# EAGLE design farmlab (EAGLE 9.5.2)
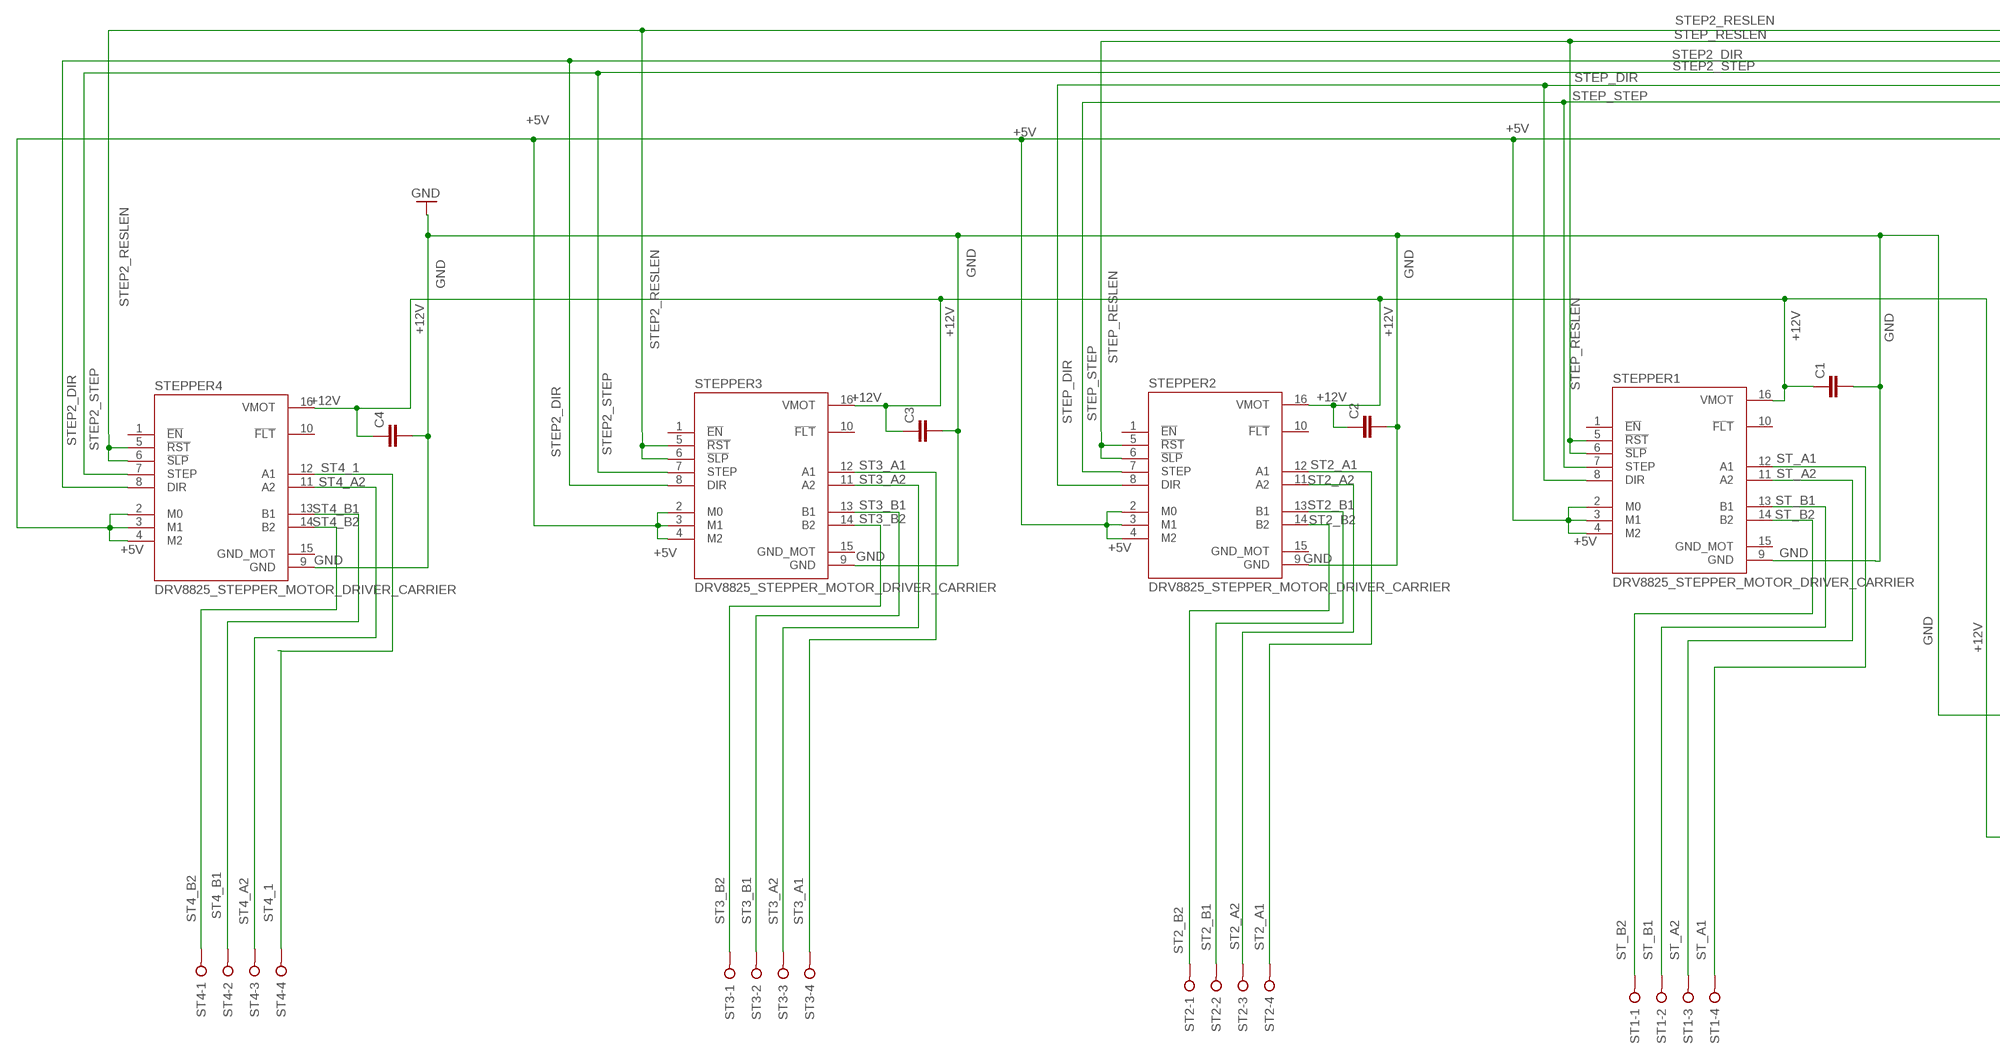
[diagram p0: schematic, sheet 1, part 1 of 2]
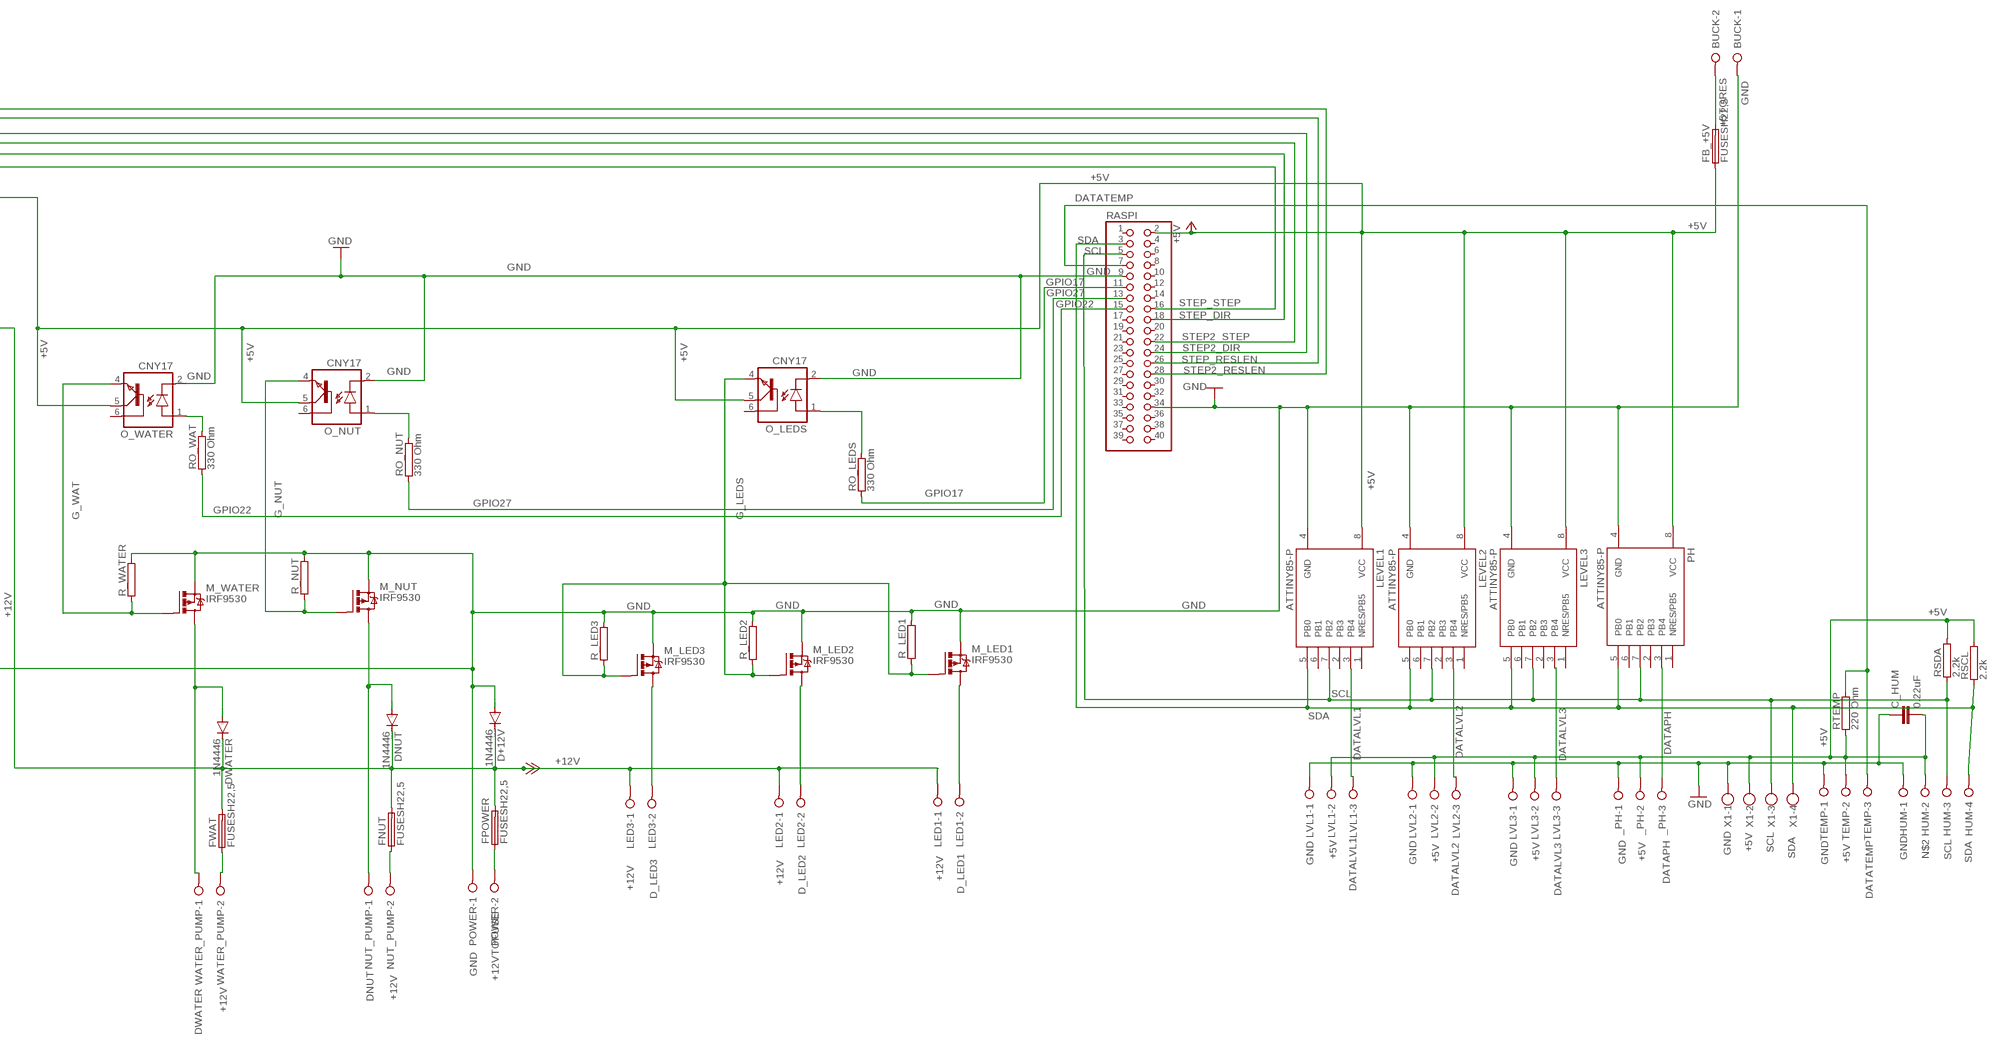
[diagram p1: schematic, sheet 1, part 2 of 2]

## Parts
_PH  W237-3E  [W237-3E]
BUCK  W237-02P  [W237-132]
C1  C2.5/6  [C2.5-6]
C2  C2.5/6  [C2.5-6]
C3  C2.5/6  [C2.5-6]
C4  C2.5/6  [C2.5-6]
C_HUM  0.22uF  C2.5/6  [C2.5-6]
D+12V  1N4446  [DO35-10]
DNUT  1N4446  [DO35-10]
DWATER  1N4446  [DO35-10]
FB_+5V  FUSESH22,5  [SH22,5]
FNUT  FUSESH22,5  [SH22,5]
FPOWER  FUSESH22,5  [SH22,5]
FWAT  FUSESH22,5  [SH22,5]
HUM  W237-04P  [W237-4P]
LED1  W237-02P  [W237-132]
LED2  W237-02P  [W237-132]
LED3  W237-02P  [W237-132]
LEVEL1  ATTINY85-P  [PDIP08_300MIL]
LEVEL2  ATTINY85-P  [PDIP08_300MIL]
LEVEL3  ATTINY85-P  [PDIP08_300MIL]
LVL1  W237-3E  [W237-3E]
LVL2  W237-3E  [W237-3E]
LVL3  W237-3E  [W237-3E]
M_LED1  IRF9530  [TO220BV]
M_LED2  IRF9530  [TO220BV]
M_LED3  IRF9530  [TO220BV]
M_NUT  IRF9530  [TO220BV]
M_WATER  IRF9530  [TO220BV]
NUT_PUMP  W237-02P  [W237-132]
O_LEDS  CNY17  [DIL06]
O_NUT  CNY17  [DIL06]
O_WATER  CNY17  [DIL06]
PH  ATTINY85-P  [PDIP08_300MIL]
POWER  W237-02P  [W237-132]
R_LED1  RAC03  [AC03]
R_LED2  RAC03  [AC03]
R_LED3  RAC03  [AC03]
R_NUT  RAC03  [AC03]
R_WATER  RAC03  [AC03]
RASPI  PINHD-2X20  [2X20]
RO_LEDS  330 Ohm  RAC03  [AC03]
RO_NUT  330 Ohm  RAC03  [AC03]
RO_WAT  330 Ohm  RAC03  [AC03]
RSCL  2.2k  RAC03  [AC03]
RSDA  2.2k  RAC03  [AC03]
RTEMP  220 Ohm  RAC03  [AC03]
ST1  W237-04P  [W237-4P]
ST2  W237-04P  [W237-4P]
ST3  W237-04P  [W237-4P]
ST4  W237-04P  [W237-4P]
STEPPER1  DRV8825_STEPPER_MOTOR_DRIVER_CARRIER  [IC_DRV8825_STEPPER_MOTOR_DRIVER_CARRIER]
STEPPER2  DRV8825_STEPPER_MOTOR_DRIVER_CARRIER  [IC_DRV8825_STEPPER_MOTOR_DRIVER_CARRIER]
STEPPER3  DRV8825_STEPPER_MOTOR_DRIVER_CARRIER  [IC_DRV8825_STEPPER_MOTOR_DRIVER_CARRIER]
STEPPER4  DRV8825_STEPPER_MOTOR_DRIVER_CARRIER  [IC_DRV8825_STEPPER_MOTOR_DRIVER_CARRIER]
TEMP  W237-3E  [W237-3E]
WATER_PUMP  W237-02P  [W237-132]
X1  W237-4  [W237-4]

## Nets
+5TORES [5V]: BUCK.2 FB_+5V.2
+5V [5V]: _PH.2 C_HUM.2 FB_+5V.1 LEVEL1.8(VCC) LEVEL2.8(VCC) LEVEL3.8(VCC) LVL1.2 LVL2.2 LVL3.2 O_LEDS.5(COL) O_NUT.5(COL) O_WATER.5(COL) PH.8(VCC) RASPI.2 RSCL.2 RSDA.2 RTEMP.1 STEPPER1.2(M0) STEPPER1.3(M1) STEPPER1.4(M2) STEPPER2.2(M0) STEPPER2.3(M1) STEPPER2.4(M2) STEPPER3.2(M0) STEPPER3.3(M1) STEPPER3.4(M2) STEPPER4.2(M0) STEPPER4.3(M1) STEPPER4.4(M2) TEMP.2 X1.2
+12V: C1.1 C2.1 C3.1 C4.1 D+12V.C DNUT.C DWATER.C FNUT.2 FPOWER.2 FWAT.2 LED1.1 LED2.1 LED3.1 STEPPER1.16(VMOT) STEPPER2.16(VMOT) STEPPER3.16(VMOT) STEPPER4.16(VMOT)
+12VTOFUSE: FPOWER.1 POWER.2
D_LED1: LED1.2 M_LED1.D
D_LED2: LED2.2 M_LED2.D
D_LED3: LED3.2 M_LED3.D
DATALVL1: LEVEL1.3(PB4) LVL1.3
DATALVL2: LEVEL2.3(PB4) LVL2.3
DATALVL3: LEVEL3.3(PB4) LVL3.3
DATAPH: _PH.3 PH.3(PB4)
DATATEMP: RASPI.7 RTEMP.2 TEMP.3
DNUT [GND]: DNUT.A M_NUT.D NUT_PUMP.1
DWATER: DWATER.A M_WATER.D WATER_PUMP.1
G_LEDS: M_LED1.G M_LED2.G M_LED3.G O_LEDS.4(EMI) R_LED1.1 R_LED2.1 R_LED3.1
G_NUT: M_NUT.G O_NUT.4(EMI) R_NUT.1
G_WAT: M_WATER.G O_WATER.4(EMI) R_WATER.1
GND [GND]: _PH.1 BUCK.1 C1.2 C2.2 C3.2 C4.2 C_HUM.1 D+12V.A HUM.1 LEVEL1.4(GND) LEVEL2.4(GND) LEVEL3.4(GND) LVL1.1 LVL2.1 LVL3.1 M_LED1.S M_LED2.S M_LED3.S M_NUT.S M_WATER.S O_LEDS.2(C) O_NUT.2(C) O_WATER.2(C) PH.4(GND) POWER.1 R_LED1.2 R_LED2.2 R_LED3.2 R_NUT.2 R_WATER.2 RASPI.9 RASPI.34 STEPPER1.9(GND) STEPPER2.9(GND) STEPPER3.9(GND) STEPPER4.9(GND) TEMP.1 X1.1
GPIO17: RASPI.11 RO_LEDS.1
GPIO22: RASPI.15 RO_WAT.1
GPIO27: RASPI.13 RO_NUT.1
N$2 [5V]: HUM.2
N$3: O_WATER.1(A) RO_WAT.2
N$4: O_NUT.1(A) RO_NUT.2
N$5: O_LEDS.1(A) RO_LEDS.2
N$6: FNUT.1 NUT_PUMP.2
N$8: FWAT.1 WATER_PUMP.2
SCL: HUM.3 LEVEL1.7(PB2) LEVEL2.7(PB2) LEVEL3.7(PB2) PH.7(PB2) RASPI.5 RSDA.1 X1.3
SDA: HUM.4 LEVEL1.5(PB0) LEVEL2.5(PB0) LEVEL3.5(PB0) PH.5(PB0) RASPI.3 RSCL.1 X1.4
ST2_A1: ST2.4 STEPPER2.12(A1)
ST2_A2: ST2.3 STEPPER2.11(A2)
ST2_B1: ST2.2 STEPPER2.13(B1)
ST2_B2: ST2.1 STEPPER2.14(B2)
ST3_A1: ST3.4 STEPPER3.12(A1)
ST3_A2: ST3.3 STEPPER3.11(A2)
ST3_B1: ST3.2 STEPPER3.13(B1)
ST3_B2: ST3.1 STEPPER3.14(B2)
ST4_1: ST4.4 STEPPER4.12(A1)
ST4_A2: ST4.3 STEPPER4.11(A2)
ST4_B1: ST4.2 STEPPER4.13(B1)
ST4_B2: ST4.1 STEPPER4.14(B2)
ST_A1: ST1.4 STEPPER1.12(A1)
ST_A2: ST1.3 STEPPER1.11(A2)
ST_B1: ST1.2 STEPPER1.13(B1)
ST_B2: ST1.1 STEPPER1.14(B2)
STEP2_DIR: RASPI.24 STEPPER3.8(DIR) STEPPER4.8(DIR)
STEP2_RESLEN: RASPI.28 STEPPER3.5(!RST) STEPPER3.6(!SLP) STEPPER4.5(!RST) STEPPER4.6(!SLP)
STEP2_STEP: RASPI.22 STEPPER3.7(STEP) STEPPER4.7(STEP)
STEP_DIR: RASPI.18 STEPPER1.8(DIR) STEPPER2.8(DIR)
STEP_RESLEN: RASPI.26 STEPPER1.5(!RST) STEPPER1.6(!SLP) STEPPER2.5(!RST) STEPPER2.6(!SLP)
STEP_STEP: RASPI.16 STEPPER1.7(STEP) STEPPER2.7(STEP)
Unconnected: LEVEL1.1(NRES/PB5) LEVEL1.2(PB3) LEVEL1.6(PB1) LEVEL2.1(NRES/PB5) LEVEL2.2(PB3) LEVEL2.6(PB1) LEVEL3.1(NRES/PB5) LEVEL3.2(PB3) LEVEL3.6(PB1) O_LEDS.6(BAS) O_NUT.6(BAS) O_WATER.6(BAS) PH.1(NRES/PB5) PH.2(PB3) PH.6(PB1) RASPI.1 RASPI.4 RASPI.6 RASPI.8 RASPI.10 RASPI.12 RASPI.14 RASPI.17 RASPI.19 RASPI.20 RASPI.21 RASPI.23 RASPI.25 RASPI.27 RASPI.29 RASPI.30 RASPI.31 RASPI.32 RASPI.33 RASPI.35 RASPI.36 RASPI.37 RASPI.38 RASPI.39 RASPI.40 STEPPER1.1(!EN) STEPPER1.10(!FLT) STEPPER2.1(!EN) STEPPER2.10(!FLT) STEPPER3.1(!EN) STEPPER3.10(!FLT) STEPPER4.1(!EN) STEPPER4.10(!FLT)

## Power pins joined to a net without a drawn wire
GND_MOT: STEPPER1.15(GND_MOT) STEPPER2.15(GND_MOT) STEPPER3.15(GND_MOT) STEPPER4.15(GND_MOT)

## Library data of the parts
_PH LVL1-LVL3 TEMP = con-wago-508:W237-3E: WAGO SREW CLAMP; OC_FARNELL: unknown; OC_NEWARK: unknown
BUCK LED1-LED3 NUT_PUMP POWER WATER_PUMP = con-wago-508:W237-02P: WAGO SREW CLAMP; OC_FARNELL: unknown; OC_NEWARK: unknown
C1-C4 C_HUM = capacitor-wima:C: CAPACITOR naming: grid - package width
D+12V DNUT DWATER = diode:1N4446: DIODE high speed (Philips)
FB_+5V FNUT FPOWER FWAT = fuse:FUSE: Fuse; OC_FARNELL: unknown; OC_NEWARK: unknown
HUM ST1-ST4 = con-wago-508:W237-04P: WAGO SREW CLAMP; OC_FARNELL: unknown; OC_NEWARK: unknown
LEVEL1-LEVEL3 PH = _hhn_attiny25_45_85:ATTINY85*: ATMEL ATtiny 85 Packages: P = PDIP 08 30mil S = SOIC 08 EIAJ 208mil Technologies Note: for complete ordering code (temp. range, finish, tape&reel etc.) see www.atmel.com • Supply Voltage: V = (1.8…5.5)V | [blank] = (2.7…5.5)V • Speed: 10 = 10 MHz | 20 = 20 MHz Author: Dipl.-Ing. FH Rainer Bayer HHN Hochschule Heilbronn (Heilbronn University), rainer.bayer@hs-heilbronn.de Ingenieurbüro ing-rb, mail@ing-rb.de
M_LED1-M_LED3 M_NUT M_WATER = transistor-power:IRF9530: P-CHANNEL HEXFET POWER-MOS-FET Source: http://www.irf.com/product-info/datasheets/data/irf9530.pdf
O_LEDS O_NUT O_WATER = optocoupler:CNY17: SIEMENS OPTO COUPLER; MPN: CNY17-1; OC_FARNELL: 1045399; OC_NEWARK: 05M4044
R_LED1-R_LED3 R_NUT R_WATER RO_LEDS RO_NUT RO_WAT RSCL RSDA RTEMP = resistor-power:R: Power Resitor; OC_FARNELL: unknown; OC_NEWARK: unknown
RASPI = pinhead:PINHD-2X20: PIN HEADER
STEPPER1-STEPPER4 = DRV8825_STEPPER_MOTOR_DRIVER_CARRIER:DRV8825_STEPPER_MOTOR_DRIVER_CARRIER: Stepper motor controler; IC: DRV8825; 1.5A; Uin mot: 8.2÷45V; AVAILABILITY: Unavailable; DESCRIPTION: Stepper motor controler; IC: DRV8825; 1.5A; Uin mot: 8.2÷45V; MF: Pololu; MP: DRV8825 STEPPER MOTOR DRIVER CARRIER; PACKAGE: None; PRICE: None
X1 = con-wago-500:W237-4: WAGO SCREW CLAMP; OC_FARNELL: unknown; OC_NEWARK: unknown

## Net classes
1 GND: width 0.5 mm
2 5V: width 0.5 mm
3 12V: width 0.1 mm
4 SDA: width 0.5 mm
5 SCL: width 0.5 mm

## Board
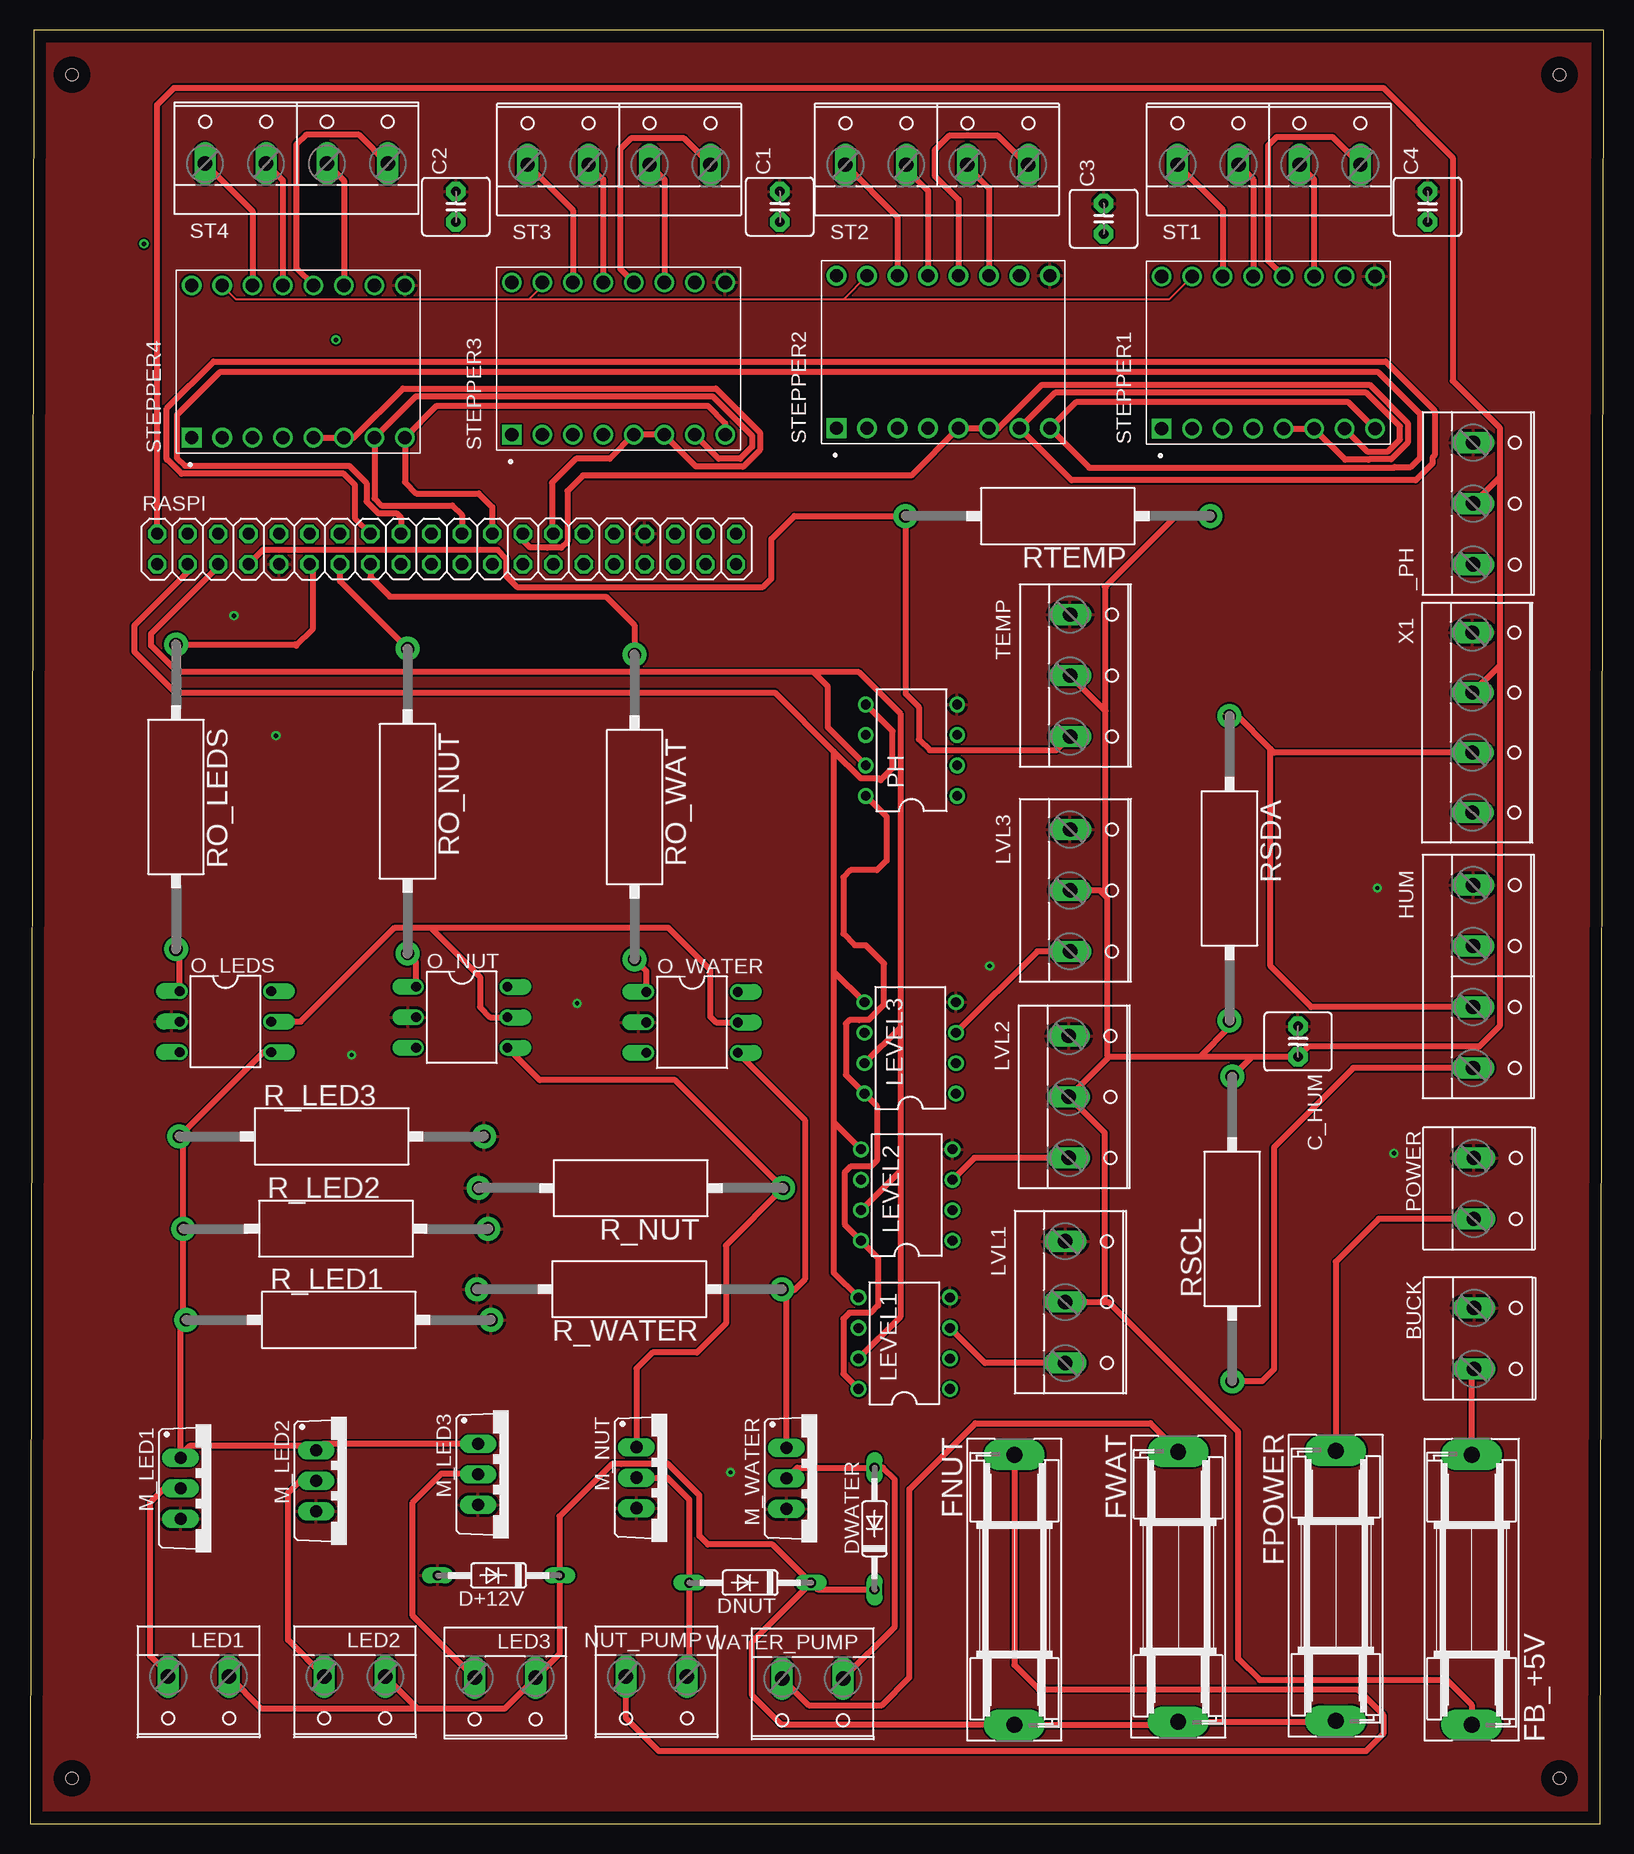
[diagram p2: board, top side]
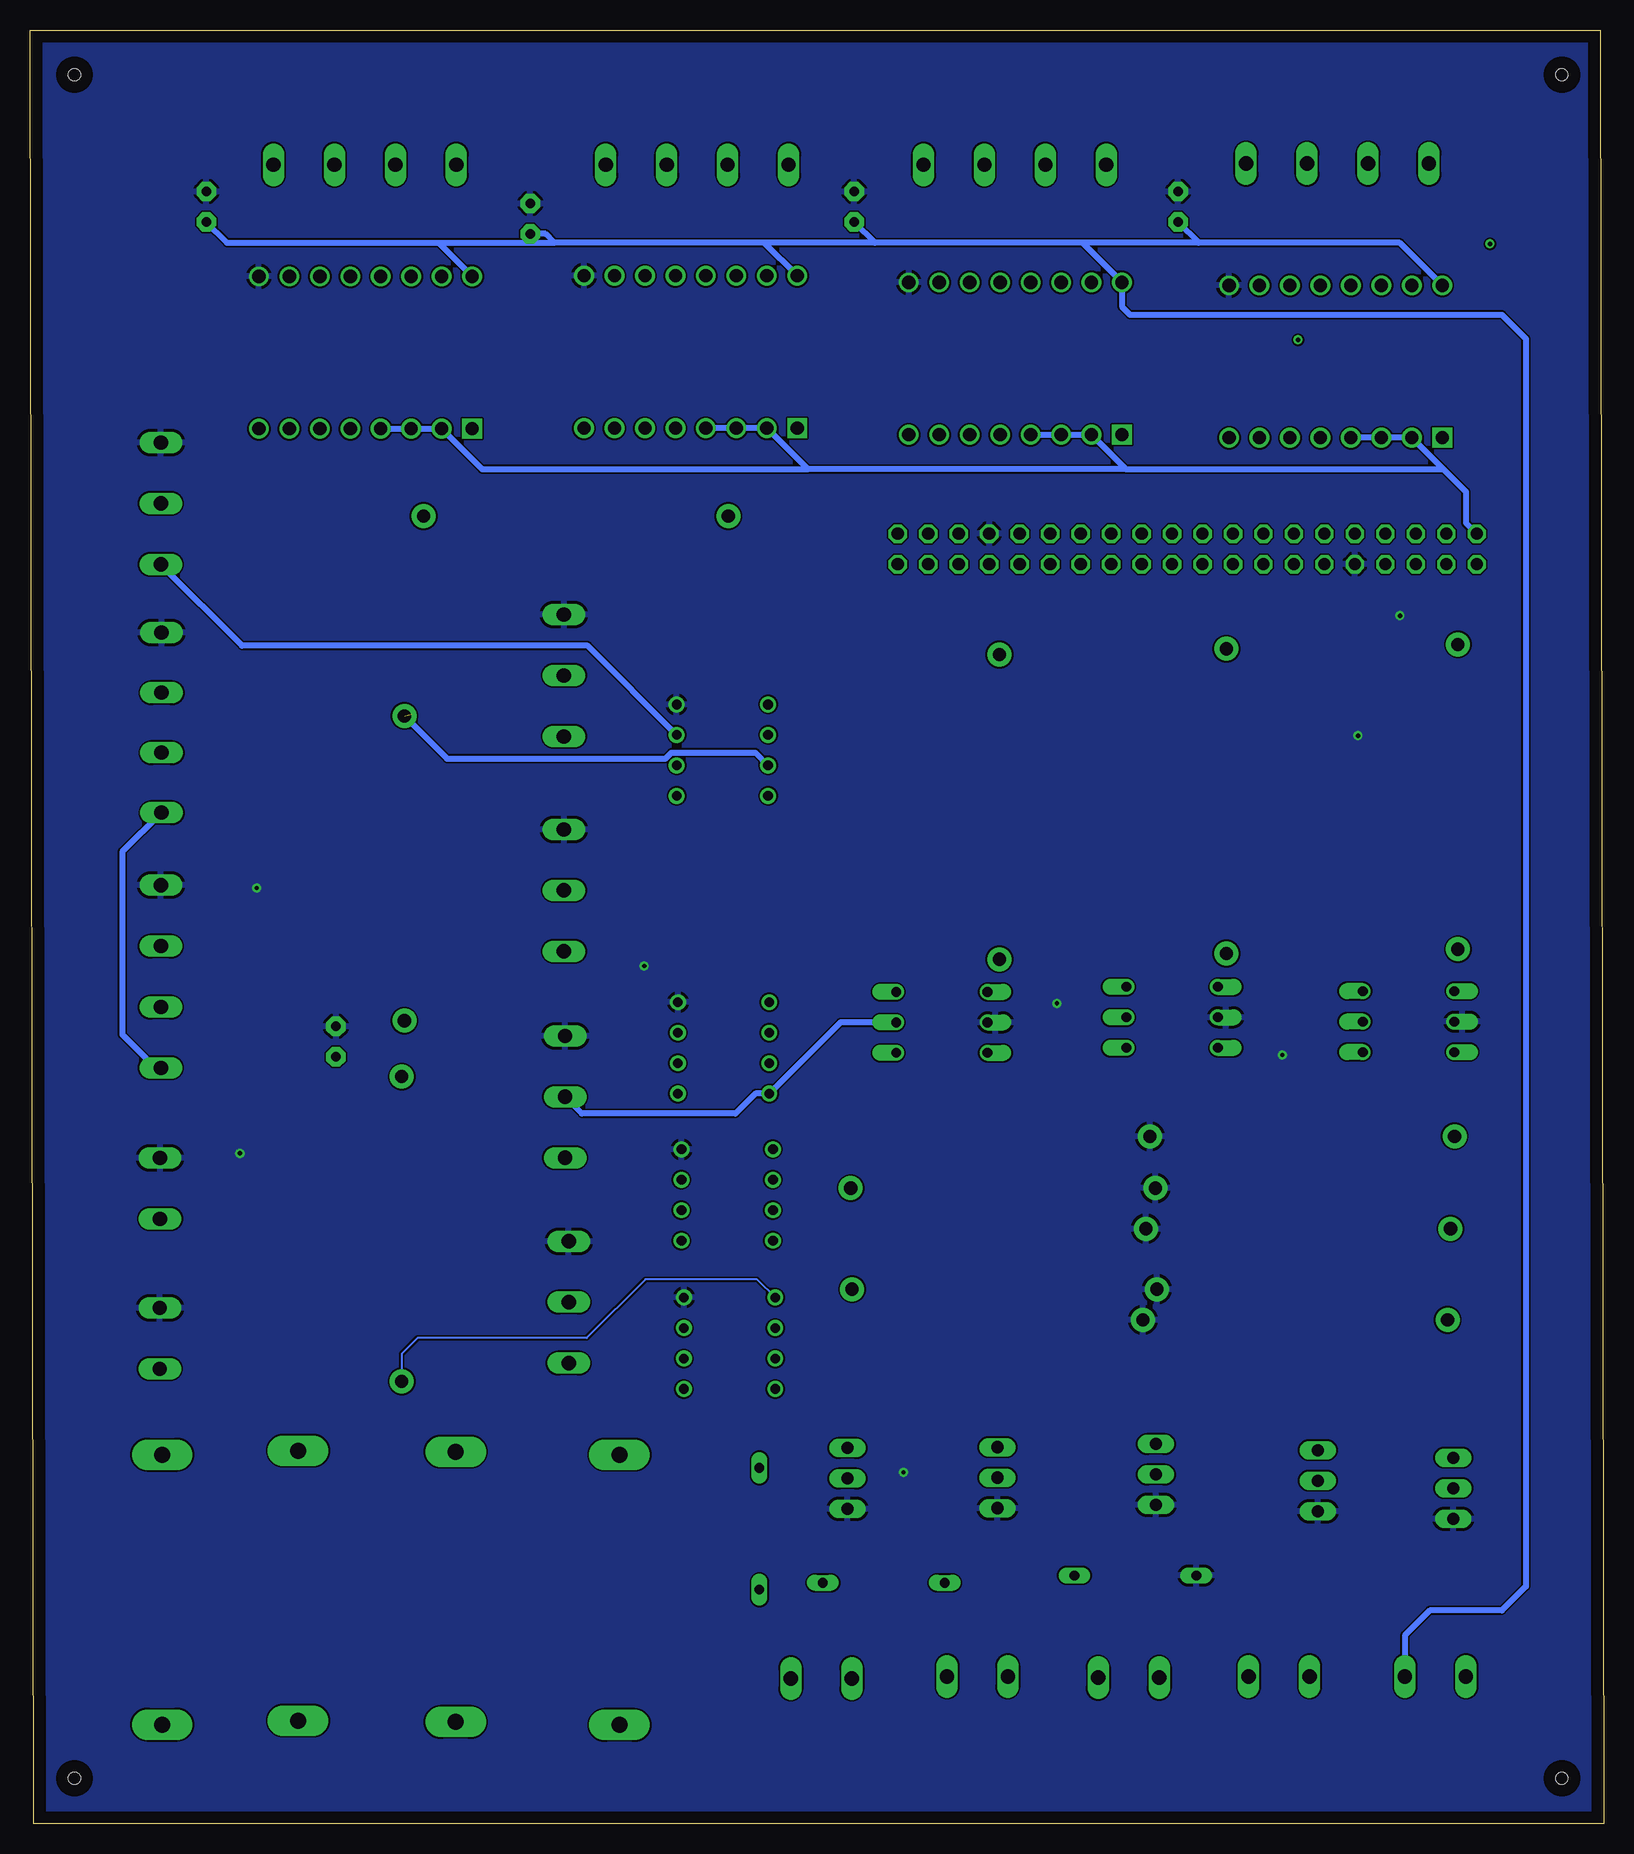
[diagram p3: board, bottom side, seen from below]

Size 131.2 x 149.53 mm. Coordinates in mm from the lower left corner, seen from the top.
Outline: 0,0 130.9,0 131.2,149.53 0.3,149.53 0,0
Copper layers (1*16): Top 0.035mm / dielectric 1.5mm / Bottom 0.035mm
Design rules "default": minimum track width 6mil, minimum drill 0.35mm, track to track 6mil, track to pad 6mil, pad to pad 6mil, via to via 6mil, smd to smd 6mil, copper to edge 40mil, drill to drill 6mil, minimum pad ring 10mil, minimum via ring 8mil, stop-mask expansion 4mil, vias tented up to drill 0mil, thermal gap 10mil
Holes 1 mm at 127.5,145.8 127.5,3.8 3.5,145.8 3.5,3.8

### Footprints (pad centres in the part's own frame; a part is rotated, then mirrored left to right if it is on the bottom)
W237-3E = drill 1.194 long: 1 -5.08,-0.635; 2 0,-0.635; 3 5.08,-0.635
W237-132 = drill 1.194 long: 1 -2.54,-0.635; 2 2.54,-0.635
C2.5-6 = drill 0.813 pad 1.6 octagon: 1 -1.27,0; 2 1.27,0
DO35-10 = drill 0.813 long: A 5.08,0; C -5.08,0
SH22,5 = drill 1.321 pad 2.54 long: 1 -11.252,0; 2 11.252,0
W237-4P = drill 1.194 long: 1 -7.62,-0.635; 2 -2.54,-0.635; 3 2.54,-0.635; 4 7.62,-0.635
PDIP08_300MIL = drill 0.813: 1 -3.81,-3.81; 2 -1.27,-3.81; 3 1.27,-3.81; 4 3.81,-3.81; 5 3.81,3.81; 6 1.27,3.81; 7 -1.27,3.81; 8 -3.81,3.81
TO220BV = drill 1.016 long: D 0,-2.54; G -2.54,-2.54; S 2.54,-2.54
DIL06 = drill 0.813 offset: 1 -2.54,-3.81; 2 0,-3.81; 3 2.54,-3.81; 4 2.54,3.81; 5 0,3.81; 6 -2.54,3.81
AC03 = drill 1.1 pad 2: 1 -12.7,0; 2 12.7,0
2X20 = drill 1.016 octagon: 1 -24.13,-1.27; 2 -24.13,1.27; 3 -21.59,-1.27; 4 -21.59,1.27; 5 -19.05,-1.27; 6 -19.05,1.27; 7 -16.51,-1.27; 8 -16.51,1.27; 9 -13.97,-1.27; 10 -13.97,1.27; 11 -11.43,-1.27; 12 -11.43,1.27; 13 -8.89,-1.27; 14 -8.89,1.27; 15 -6.35,-1.27; 16 -6.35,1.27; 17 -3.81,-1.27; 18 -3.81,1.27; 19 -1.27,-1.27; 20 -1.27,1.27; 21 1.27,-1.27; 22 1.27,1.27; 23 3.81,-1.27; 24 3.81,1.27; 25 6.35,-1.27; 26 6.35,1.27; 27 8.89,-1.27; 28 8.89,1.27; 29 11.43,-1.27; 30 11.43,1.27; 31 13.97,-1.27; 32 13.97,1.27; 33 16.51,-1.27; 34 16.51,1.27; 35 19.05,-1.27; 36 19.05,1.27; 37 21.59,-1.27; 38 21.59,1.27; 39 24.13,-1.27; 40 24.13,1.27
IC_DRV8825_STEPPER_MOTOR_DRIVER_CARRIER = drill 1.1 square: 1 -6.35,8.89 | drill 1.1: 2 -6.35,6.35; 3 -6.35,3.81; 4 -6.35,1.27; 5 -6.35,-1.27; 6 -6.35,-3.81; 7 -6.35,-6.35; 8 -6.35,-8.89; 9 6.35,-8.89; 10 6.35,-6.35; 11 6.35,-3.81; 12 6.35,-1.27; 13 6.35,1.27; 14 6.35,3.81; 15 6.35,6.35; 16 6.35,8.89
W237-4 = drill 1.194 long: 1 -7.5,-1.27; 2 -2.5,-1.27; 3 2.5,-1.27; 4 7.5,-1.27

### Placement (x,y rotation side)
_PH  120.93,110.06 270 top
BUCK  121.02,40.47 270 top
C1  62.5,134.8 90 top
C2  35.5,134.8 90 top
C3  89.5,133.8 90 top
C4  116.5,134.8 90 top
C_HUM  105.7,65.21 270 top
D+12V  39.06,20.7 180 top
DNUT  60.03,20.1 180 top
DWATER  70.4,24.6 90 top
FB_+5V  120.18,19.52 90 top
FNUT  82.06,19.51 270 top
FPOWER  108.85,19.85 270 top
FWAT  95.71,19.76 270 top
HUM  120.93,70.63 270 top
LED1  14.05,11.65 180 top
LED2  27.08,11.65 180 top
LED3  39.61,11.55 180 top
LEVEL1  72.88,40.06 90 top
LEVEL2  73.08,52.42 90 top
LEVEL3  73.38,64.68 90 top
LVL1  86.93,43.49 270 top
LVL2  87.23,60.6 270 top
LVL3  87.33,77.81 270 top
M_LED1  15.09,27.97 270 top
M_LED2  26.39,28.6 270 top
M_LED3  39.89,29.13 270 top
M_NUT  53.09,28.86 270 top
M_WATER  65.59,28.79 270 top
NUT_PUMP  52.22,11.65 180 top
O_LEDS  16.29,66.87 270 top
O_NUT  35.99,67.23 270 top
O_WATER  55.19,66.81 270 top
PH  73.48,89.5 90 top
POWER  120.99,52.97 270 top
R_LED1  25.73,42.01 0 top
R_LED2  25.49,49.61 0 top
R_LED3  25.15,57.31 0 top
R_NUT  50.09,52.99 180 top
R_WATER  49.97,44.57 180 top
RASPI  34.73,106.27 0 top
RO_LEDS  12.17,85.61 270 top
RO_NUT  31.47,85.25 270 top
RO_WAT  50.39,84.77 270 top
RSCL  100.21,49.59 90 top
RSDA  99.99,79.65 270 top
RTEMP  85.69,109.01 180 top
ST1  103.28,138.93 0 top
ST2  75.59,138.93 0 top
ST3  49.1,138.93 0 top
ST4  22.21,139.03 0 top
STEPPER1  103.23,122.64 90 top
STEPPER2  76.13,122.69 90 top
STEPPER3  49.06,122.14 90 top
STEPPER4  22.36,121.89 90 top
TEMP  87.33,95.72 270 top
WATER_PUMP  65.24,11.48 180 top
X1  121.5,91.8 270 top

### Tracks (layer width: path | path; a pad name or v marks a point on that pad's centre or on a via)
+5TORES
  Top 0.5: FB_+5V.2 120.18,37.72 BUCK.2
+5V
  Top 0.5: RASPI.2 10.6,143.3 12,144.7 112.8,144.7 118.6,138.9 118.6,120.3 122.5,116.4 122.5,112.27 | 122.5,112.27 122.5,96.57 | 122.5,96.57 122.5,66.5 120.8,64.8 106.56,64.8 C_HUM.2 101.86,63.94 | 101.86,63.94 97.5,63.94 | 97.5,63.94 89.94,63.94 | 89.94,63.94 LVL2.2 89.6,57.59 89.6,43.49 | PH.8 71.4,83.96 71.4,80.3 70.6,79.5 68.4,79.5 67.8,78.9 67.8,74.2 68.77,73.23 69.67,73.23 71.2,71.7 71.2,68.3 69.91,67.01 69.13,67.01 69.12,67 68.3,67 68,66.7 68,62.44 LEVEL3.8 70.6,59.84 70.6,55.3 70.1,54.8 68.4,54.8 67.9,54.3 67.9,49.98 LEVEL2.8 70.7,47.18 70.7,43.2 70.1,42.6 68.3,42.6 67.8,42.1 67.8,37.52 LEVEL1.8 | O_LEDS.5 22.57,66.87 30.4,74.7 33.4,74.7 | 33.4,74.7 37.5,70.6 37.5,68.1 38.37,67.23 O_NUT.5 | 33.4,74.7 53.2,74.7 56.7,71.2 56.7,67.3 57.19,66.81 O_WATER.5 | LVL1.2 89.6,43.49 | 89.6,43.49 89.91,43.49 100.7,32.7 100.7,13.8 102.5,12 118.1,12 120.18,9.92 FB_+5V.1 | 89.94,63.94 89.8,64.08 89.8,77.2 89.65,77.35 | 89.65,77.35 89.19,77.81 LVL3.2 | 89.65,77.35 89.65,92.77 | TEMP.2 89.65,92.77 | 89.65,92.77 89.65,103.05 89.6,103.1 95.51,109.01 RTEMP.1 | X1.2 122.5,96.57 | 97.5,63.94 99.99,66.43 RSDA.2 | RSCL.2 101.86,63.94 | _PH.2 122.5,112.27
  Bottom 0.5: O_WATER.5 63.63,66.81 LEVEL3.8 70.73,60.87 72.4,59.2 85.19,59.2 LVL2.2 | STEPPER4.4 STEPPER4.3 STEPPER4.2 13.38,112.91 | 13.38,112.91 11.5,111.03 11.5,108.44 RASPI.2 | STEPPER3.4 STEPPER3.3 STEPPER3.2 39.84,112.91 | 39.84,112.91 13.38,112.91 | 39.84,112.91 66.35,112.91 | 66.35,112.91 STEPPER2.2 STEPPER2.3 STEPPER2.4 | STEPPER1.4 STEPPER1.3 STEPPER1.2 93.5,112.91 66.35,112.91
+12V
  Top 0.5: DWATER.C 65.69,19.52 DNUT.C | DNUT.C 61.91,23.3 56.5,23.3 55.8,24 55.8,27.4 53.18,30.02 49.31,30.02 49.28,30 48.5,30 44.14,25.64 D+12V.C 44.14,14.18 LED3.1 39.56,9.6 32.3,9.6 | 32.3,9.6 LED2.1 | 32.3,9.6 19.27,9.6 LED1.1 | DNUT.C 60.2,15.19 60.2,10.7 62.64,8.26 FNUT.2 95.46,8.26 FWAT.2 108.76,8.51 FPOWER.2
  Bottom 0.5: STEPPER4.16 17.03,131.8 33.77,131.8 | C2.1 33.77,131.8 | 33.77,131.8 43.48,131.8 | 43.48,131.8 60.77,131.8 | C1.1 60.77,131.8 | 60.77,131.8 70,131.8 | 70,131.8 87.5,131.8 | 97.15,131.8 114.77,131.8 C4.1 | 97.15,131.8 87.5,131.8 | 87.5,131.8 88.23,132.53 C3.1 | 43.48,131.8 STEPPER3.16 40.17,126.47 39.5,125.8 8.5,125.8 6.5,123.8 6.5,19.8 8.5,17.8 14.5,17.8 16.59,15.71 LED1.1 | STEPPER2.16 70,131.8 | STEPPER1.16 97.15,131.8
+12VTOFUSE
  Top 0.5: POWER.2 112.43,50.43 108.85,46.85 FPOWER.1
D_LED1
  Top 0.5: LED1.2 11.51,12.49 10,14 10,26.8 11.3,28.1 12.42,28.1 M_LED1.D
D_LED2
  Top 0.5: LED2.2 21.5,15.32 21.5,27.6 22.5,28.6 M_LED2.D
D_LED3
  Top 0.5: LED3.2 31.9,17.36 31.9,26.8 34.3,29.2 37.28,29.2 M_LED3.D
DATALVL1
  Top 0.5: LVL1.3 79.61,38.41 LEVEL1.3
DATALVL2
  Top 0.5: LVL2.3 78.72,55.52 LEVEL2.3
DATALVL3
  Top 0.5: LVL3.3 83.97,72.73 LEVEL3.3
DATAPH
  Bottom 0.5: PH.3 84.72,98.2 113.52,98.2 _PH.3
DATATEMP
  Top 0.5: RASPI.7 19.42,106.2 38.99,106.2 39.7,105.48 39.7,104 40.6,103.1 61.1,103.1 61.8,103.8 61.8,107.1 63.71,109.01 RTEMP.2 72.99,94.21 74.1,93.1 74.1,90.4 75,89.5 85.56,89.5 TEMP.3
DNUT
  Top 0.5: M_NUT.D 53.14,28.86 54.95,27.05 DNUT.A 54.95,12.47 NUT_PUMP.1
DWATER
  Top 0.5: M_WATER.D 63.94,29.68 70.2,29.68 DWATER.A 71.12,29.68 72.1,28.7 72.1,16.43 WATER_PUMP.1
G_LEDS
  Top 0.5: M_LED3.G 24.38,31.67 M_LED2.G 23.49,31.5 13.3,31.5 12.55,30.75 M_LED1.G 12.55,41.53 R_LED1.1 12.79,42.25 R_LED2.1 12.79,56.97 R_LED3.1 19.47,64.33 O_LEDS.4
G_NUT
  Top 0.5: O_NUT.4 42.49,62 53.78,62 R_NUT.1 58,48.2 58,41.7 55.6,39.3 51.9,39.3 50.55,37.95 M_NUT.G
G_WAT
  Top 0.5: M_WATER.G 63.05,44.19 62.77,44.47 | 62.77,44.47 R_WATER.1 | O_WATER.4 64.6,58.67 64.6,45.4 63.67,44.47 62.77,44.47
GND  (via drill 0.35)
  other vias: 17,100.7 20.5,90.7 26.8,64.1 45.6,68.4 58.4,29.3 113.7,55.9 112.3,78 80,71.5
  pour Top: -73,234.1 229.6,234.1 292.9,170.8 292.9,-87.3 288.8,-91.4 -59,-91.4 -99.3,-51.1 -99.3,207.8
  pour Bottom: -35.2,167.4 -20.5,182.1 188,182.1 215,155.1 215,144.1 215,26.5 160,-28.5 6.3,-28.5 -49.2,27 -49.2,153.4
GND1  (via drill 0.35)
  other vias: 25.5,123.7
GND2  (via drill 0.35)
  other vias: 9.5,131.7
GND_MOT
  Top 0.152: STEPPER4.15 17.15,127.1 41.6,127.1 | 41.6,127.1 42.71,128.21 STEPPER3.15 | 41.6,127.1 67.84,127.1 | 67.84,127.1 STEPPER2.15 | 67.84,127.1 94.99,127.1 STEPPER1.15
GPIO17
  Top 0.5: RO_LEDS.1 22.09,98.31 22.2,98.2 23.6,99.6 23.6,104.7 RASPI.11
GPIO22
  Top 0.5: RASPI.15 28.38,103.92 30,102.3 48,102.3 50.39,99.91 RO_WAT.1
GPIO27
  Top 0.5: RO_NUT.1 25.84,103.58 RASPI.13
N$3
  Top 0.5: O_WATER.1 51.38,71.08 RO_WAT.2
N$4
  Top 0.5: O_NUT.1 32.18,71.84 RO_NUT.2
N$5
  Top 0.5: O_LEDS.1 12.48,72.6 RO_LEDS.2
N$6
  Top 0.5: FNUT.1 82.06,13.24 84.1,11.2 110.7,11.2 112.8,9.1 112.8,7.5 111.37,6.07 52.43,6.07 49.68,8.82 NUT_PUMP.2
N$8
  Top 0.5: WATER_PUMP.2 64.91,9.9 71,9.9 73.3,12.2 73.3,27.9 78.8,33.4 93.4,33.4 95.71,31.09 FWAT.1
SCL  (1 unrouted)
  Top 0.5: RASPI.5 15.68,104.78 10.1,99.2 10.1,98.2 12.3,96 65.3,96 | 65.3,96 69.1,96 72.55,92.55 72.55,66.39 | 72.55,66.39 LEVEL3.7 | 72.55,66.39 72.55,54.43 | 72.55,54.43 72.55,42.27 LEVEL1.7 | LEVEL2.7 72.55,54.43 | HUM.3 106.81,68.09 103.4,71.5 103.4,89.6 | 103.4,89.6 100.5,92.5 99.4,92.5 | X1.3 103.7,89.3 103.4,89.6 | PH.7 66.5,91.4 66.5,94.8 65.3,96
  Bottom 0.5: RSDA.1 96.44,88.8 78.22,88.8 77.73,89.29 70.73,89.29 PH.7
SDA
  Top 0.5: HUM.4 110.31,63.01 103.7,56.4 103.7,37.9 102.69,36.89 RSCL.1 | RASPI.3 13.14,104.34 8.7,99.9 8.7,97.7 12.1,94.3 62.1,94.3 67,89.4 | 67,89.4 69.23,87.17 70.73,87.17 70.9,87 71.9,88 71.9,91.08 PH.5 | 67,89.4 67,71.06 | 67,71.06 LEVEL3.5 | 67,71.06 67,58.5 | 67,58.5 LEVEL2.5 | 67,58.5 67,45.94 LEVEL1.5
  Bottom 0.152: LEVEL1.5 70.6,45.4 79.9,45.4 84.8,40.5 98.9,40.5 100.21,39.19 RSCL.1
  Bottom 0.5: RSCL.1 100.11,36.89 | X1.4 123.5,81.03 123.5,65.8 120.71,63.01 HUM.4
ST2_A1
  Top 0.5: ST2.4 83.11,138.3 80.7,140.7 76.6,140.7 75.4,139.5 75.4,137.4 77.4,135.4 STEPPER2.12
ST2_A2
  Top 0.5: ST2.3 78.13,138.17 79.94,136.36 STEPPER2.11
ST2_B1
  Top 0.5: ST2.2 73.05,137.95 74.86,136.14 STEPPER2.13
ST2_B2
  Top 0.5: ST2.1 72.32,133.95 STEPPER2.14
ST3_A1
  Top 0.5: ST3.4 54.52,140.5 50.1,140.5 49.2,139.6 49.2,129.62 STEPPER3.12
ST3_A2
  Top 0.5: ST3.3 52.9,137.04 52.9,128.52 STEPPER3.11
ST3_B1
  Top 0.5: ST3.2 47.79,137.06 STEPPER3.13
ST3_B2
  Top 0.5: ST3.1 45.25,134.53 STEPPER3.14
ST4_1
  Top 0.5: ST4.4 27.43,140.8 23,140.8 22.2,140 22.2,129.67 STEPPER4.12
ST4_A2
  Top 0.5: ST4.3 26.17,136.98 STEPPER4.11
ST4_B1
  Top 0.5: STEPPER4.13 21.09,136.98 ST4.2
ST4_B2
  Top 0.5: ST4.1 18.55,134.44 STEPPER4.14
ST_A1
  Top 0.5: ST1.4 108.59,140.6 103.9,140.6 103.2,139.9 103.2,130.29 STEPPER1.12
ST_A2
  Top 0.5: ST1.3 107.04,137.08 STEPPER1.11
ST_B1
  Top 0.5: ST1.2 101.96,137.08 STEPPER1.13
ST_B2
  Top 0.5: ST1.1 99.42,134.54 STEPPER1.14
STEP2_DIR
  Top 0.5: RASPI.24 38.54,109.76 37.4,110.9 32.2,110.9 31.25,111.85 STEPPER4.8 33.91,118.2 56.5,118.2 57.95,116.75 STEPPER3.8
STEP2_RESLEN
  Top 0.5: STEPPER4.5 STEPPER4.6 26.97,115.54 31.09,119.65 57.17,119.65 60.85,115.97 60.85,114.53 59.47,113.15 59.45,113.15 | 59.45,113.15 59.4,113.1 | 43.8,107.72 RASPI.28 43.5,107.66 43.5,111.8 45.5,113.8 48.34,113.8 STEPPER3.5 STEPPER3.6 55.51,113.15 59.45,113.15
STEP2_STEP
  Top 0.5: RASPI.22 36,109.1 35.2,109.9 29.3,109.9 28.71,110.49 STEPPER4.7 32.17,119 56.9,119 60.2,115.7 60.2,114.8 59.2,113.8 57.4,113.8 STEPPER3.7
STEP_DIR
  Top 0.5: STEPPER1.8 109.91,118.5 87.18,118.5 STEPPER2.8 88.31,113.05 113.69,113.05 113.75,113.1 115.1,113.1 115.9,113.9 115.9,117.5 112.4,121 15.8,121 12.24,117.44 12.24,113.86 12.9,113.2 26.6,113.2 28.06,111.74 28.06,110.22 29.03,109.25 30.55,109.25 30.92,108.88 RASPI.18
STEP_RESLEN
  Top 0.5: RASPI.26 41.08,107.02 41.7,106.4 43.11,106.4 43.14,106.38 44.28,106.38 44.8,106.9 44.8,111.1 46.1,112.4 73.46,112.4 STEPPER2.5 STEPPER2.6 80.74,116.34 84.36,119.95 111.67,119.95 114.85,116.77 114.85,115.13 113.47,113.75 111.65,113.75 111.6,113.7 109.63,113.7 STEPPER1.6 STEPPER1.5
STEP_STEP
  Top 0.5: STEPPER1.7 111.47,114.4 113.2,114.4 114.2,115.4 114.2,116.5 111.4,119.3 85.44,119.3 STEPPER2.7 86.82,112 115.5,112 116.9,113.4 116.9,113.88 117.1,114.08 117.1,117.8 113,121.9 15.3,121.9 11.4,118 11.4,113.7 11.48,113.7 12.63,112.55 26.15,112.55 27.1,111.6 27.1,108.82 RASPI.16